# Altium schematic sheet 海关全向控制器主控板电路V2_USB-GL852G.SchDoc
size A4
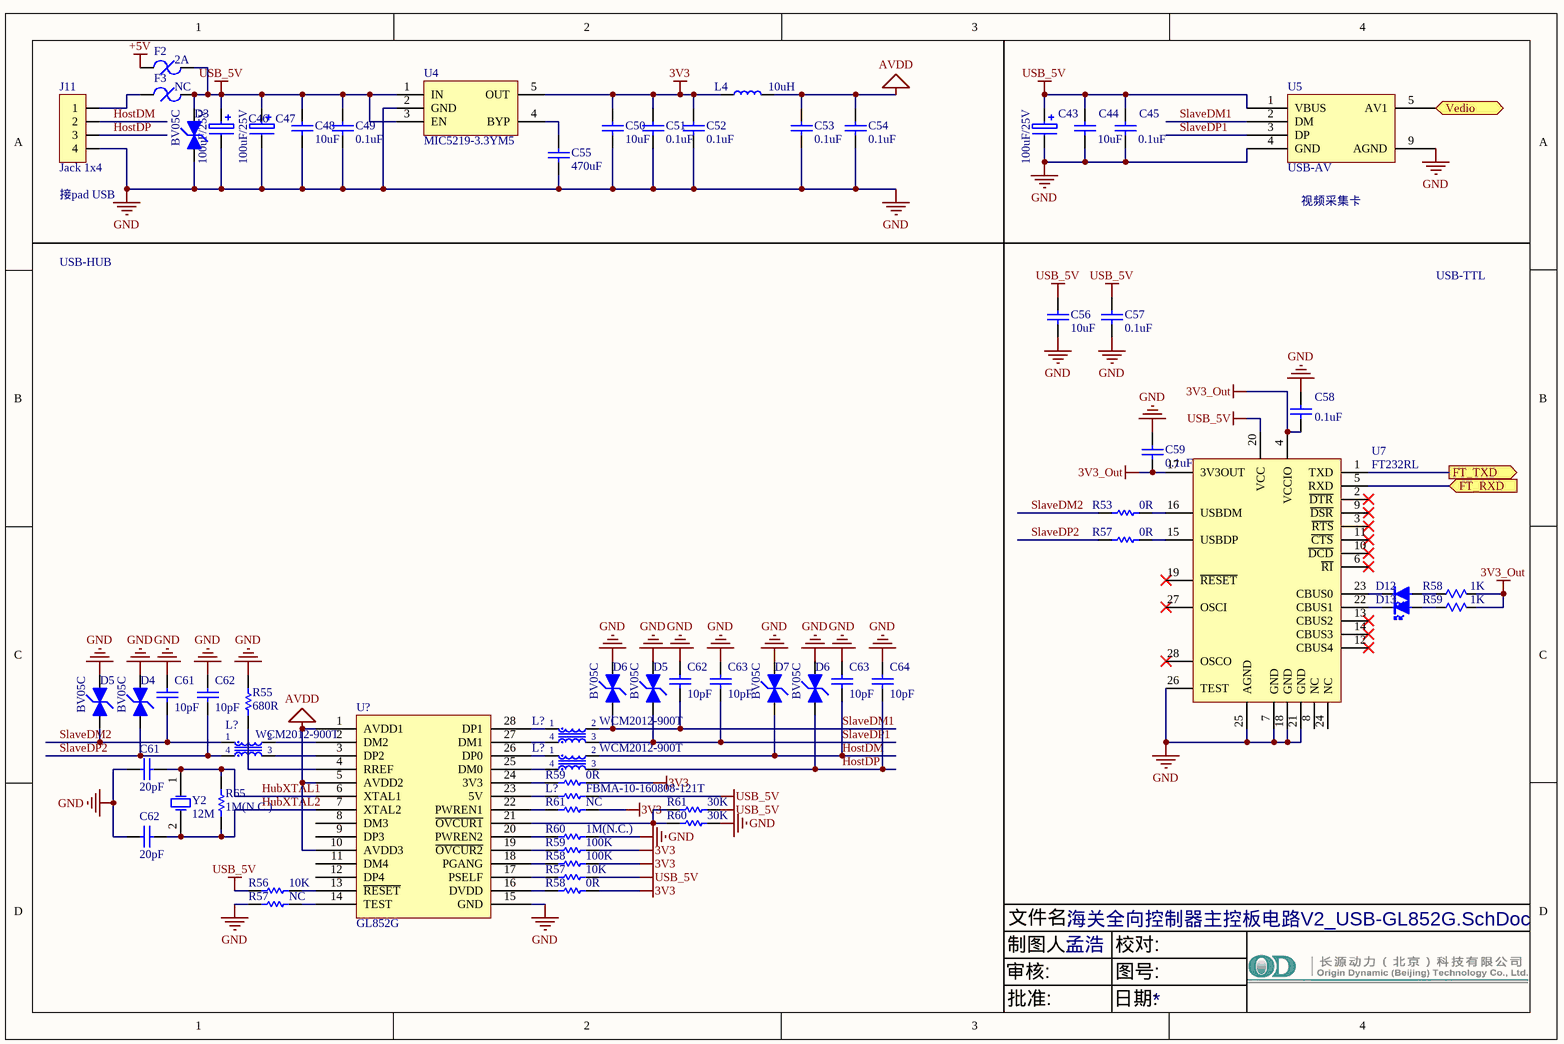
[diagram p0: 海关全向控制器主控板电路V2_USB-GL852G.SchDoc]

## Parts
(Parts that share a designator on the sheet are numbered #1, #2 ... from top to bottom, then left to right.)
C43  100uF/25V  [C7343]
C44  10uF  [C0603]
C45  0.1uF  [C0603]
C46  100uF/25V  [C7343]
C47  100uF/25V  [C7343]
C48  10uF  [C0603]
C49  0.1uF  [C0603]
C50  10uF  [C0603]
C51  0.1uF  [C0603]
C52  0.1uF  [C0603]
C53  0.1uF  [C0603]
C54  0.1uF  [C0603]
C55  470uF  [C0603]
C56  10uF  [C0603]
C57  0.1uF  [C0603]
C58  0.1uF  [C0603]
C59  0.1uF  [C0603]
C61#1  10pF  [C0603]
C61#2  20pF  [C0603]
C62#1  10pF  [C0603]
C62#2  10pF  [C0603]
C62#3  20pF  [C0603]
C63#1  10pF  [C0603]
C63#2  10pF  [C0603]
C64  10pF  [C0603]
D3  BV05C  [SOD323]
D4  BV05C  [SOD323]
D5#1  BV05C  [SOD323]
D5#2  BV05C  [SOD323]
D6#1  BV05C  [SOD323]
D6#2  BV05C  [SOD323]
D7  BV05C  [SOD323]
D12  LED  [LED0603]  (value not drawn)
D13  LED  [LED0603]  (value not drawn)
F2  2A  [F1218]
F3  NC  [F1218]
J11  Jack 1x4  [ZH1.5-4AWD]
L4  10uH  [L0805]
L?#1  WCM2012-900T  [WCM2012-900T]
L?#2  WCM2012-900T  [WCM2012-900T]
L?#3  WCM2012-900T  [WCM2012-900T]
L?#4  FBMA-10-160808-121T  [R0603]
R53  0R  [R0603]
R55  680R  [R0603]
R56  10K  [R0603]
R57#1  0R  [R0603]
R57#2  10K  [R0603]
R57#3  NC  [R0603]
R58#1  1K  [R0603]
R58#2  100K  [R0603]
R58#3  0R  [R0603]
R59#1  1K  [R0603]
R59#2  0R  [R0603]
R59#3  100K  [R0603]
R60#1  30K  [R0603]
R60#2  1M(N.C.)  [R0603]
R61#1  NC  [R0603]
R61#2  30K  [R0603]
R65  1M(N.C.)  [R0603]
U4  MIC5219-3.3YM5  [SOT-23-5]
U5  USB-AV  [USB-AV]
U7  FT232RL  [SSOP-28]
U?  GL852G  [SSOP-28]
Y2  12M  [HC49S]

## Ports
FT_RXD (in), FT_TXD (out), Vedio (in)

## Nets
3V3: C50.1 C51.2 C52.2 L4.1 R58#2.1 R58#3.1 R59#2.1 R59#3.1 R61#1.1 U4.5(OUT)
3V3_Out: C58.2 C59.1 R58#1.1 R59#1.1 U7.4(VCCIO) U7.17(3V3OUT)
+5V: F2.1
AVDD: C53.2 C54.2 L4.2 U?.1(AVDD1) U?.5(AVDD2) U?.10(AVDD3)
GND: C43.2 C44.2 C45.1 C46.2 C47.2 C48.2 C49.1 C50.2 C51.1 C52.1 C53.1 C54.1 C55.1 C56.2 C57.1 C58.1 C59.2 C61#1.2 C61#2.2 C62#1.2 C62#2.2 C62#3.2 C63#1.2 C63#2.2 C64.2 D3.2(K) D4.1(A) D5#1.1(A) D5#2.1(A) D6#1.1(A) D6#2.1(A) D7.1(A) J11.4 R55.2 R57#3.2 R60#1.1 R60#2.1 U4.2(GND) U5.4(GND) U5.9(AGND) U7.7(GND) U7.18(GND) U7.21(GND) U7.25(AGND) U7.26(TEST) U?.15(GND)
USB_5V: C43.1 C44.1 C45.2 C46.1 C47.1 C48.1 C49.2 C56.1 C57.2 D3.1(A) F2.2 F3.2 L?#4.2 R56.2 R57#2.1 R61#2.1 U4.1(IN) U4.3(EN) U5.1(VBUS) U7.20(VCC)
FT_RXD: U7.5(RXD) ; port FT_RXD
FT_TXD: U7.1(TXD) ; port FT_TXD
HostDM: C62#1.1 C63#1.1 C63#2.1 D5#1.2(K) D6#1.2(K) D7.2(K) J11.2 L?#1.2 L?#1.3 L?#3.2 U5.2(DM) U5.3(DP)  [also labelled SlaveDM1, SlaveDP1]
HostDP: C64.1 D6#2.2(K) J11.3 L?#3.3
HubXTAL1: C61#2.1 R65.2 U?.6(XTAL1) Y2.1(OSC1)
HubXTAL2: C62#3.1 R65.1 U?.7(XTAL2) Y2.2(OSC2)
SlaveDM2: C61#1.1 D5#2.2(K) L?#2.1 R53.1
SlaveDP2: C62#2.1 D4.2(K) L?#2.4 R57#1.1
Vedio: U5.5(AV1) ; port Vedio
NetC55_2: C55.2 U4.4(BYP)
NetD12_1: D12.1(A) R58#1.2
NetD12_2: D12.2(K) U7.23(CBUS0)
NetD13_1: D13.1(A) R59#1.2
NetD13_2: D13.2(K) U7.22(CBUS1)
NetF3_1: F3.1 J11.1
NetL?#1_1: L?#1.1 U?.28(DP1)
NetL?#1_4: L?#1.4 U?.27(DM1)
NetL?#2_2: L?#2.2 U?.2(DM2)
NetL?#2_3: L?#2.3 U?.3(DP2)
NetL?#3_1: L?#3.1 U?.26(DP0)
NetL?#3_4: L?#3.4 U?.25(DM0)
NetL?#4_1: L?#4.1 U?.23(5V)
NetR53_2: R53.2 U7.16(USBDM)
NetR55_1: R55.1 U?.4(RREF)
NetR56_1: R56.1 U?.13(~{RESET})
NetR57#1_2: R57#1.2 U7.15(USBDP)
NetR57#2_2: R57#2.2 U?.17(PSELF)
NetR57#3_1: R57#3.1 U?.14(TEST)
NetR58#2_2: R58#2.2 U?.18(PGANG)
NetR58#3_2: R58#3.2 U?.16(DVDD)
NetR59#2_2: R59#2.2 U?.24(3V3)
NetR59#3_2: R59#3.2 U?.19(~{OVCUR2})
NetR60#1_2: R60#1.2 R61#2.2 U?.21(~{OVCUR1})
NetR60#2_2: R60#2.2 U?.20(PWREN2)
NetR61#1_2: R61#1.2 U?.22(PWREN1)

Not connected (* = marked no-connect by the designer): U7 2(~{DTR})* 3(~{RTS})* 6(~{RI})* 8(NC) 9(~{DSR})* 10(~{DCD})* 11(~{CTS})* 12(CBUS4)* 13(CBUS2)* 14(CBUS3)* 19(~{RESET})* 24(NC) 27(OSCI)* 28(OSCO)*; U? 8(DM3) 9(DP3) 11(DM4) 12(DP4)

## Notes on the sheet
- (near J11) 接pad USB
- (near U5) 视频采集卡
- USB-HUB
- USB-TTL
- 文件名:
- 审核:
- 制图人:
- 孟浩
- 校对:
- 图号:
- 批准:
- 日期:

## Library data of the parts
C43 C46 C47 = Cap Poll
C44 C48 C50 C56 = CAP: Published: 8-Jun-2000; LatestRevisionDate: 17-Jul-2002; LatestRevisionNote: Re-released for DXP Platform.; PackageReference: RAD-0.3; Publisher: Altium Limited; Value: 10uF
C45 C49 C51-C55 C57 C59 C61#1 C61#2 C62#1-C62#3 C63#1 C63#2 C64 = Cap Semi
C58 = Cap: Capacitor; Value: 22pF; Published: 8-Jun-2000; Revision: July-2002: Re-released for DXP Platform.; Publisher: Altium Limited
D3 D4 D5#1 D5#2 D6#1 D6#2 D7 = Diode-TVS
F2 F3 = Fuse2
J11 = Jack 1x4: 插座
L4 = Inductor
L?#4 R53 R55 R56 R57#1-R57#3 R58#2 R58#3 R59#2 R59#3 R60#1 R60#2 R61#1 R61#2 R65 = Res
R58#1 R59#1 = Res: Resistor; Published: 8-Jun-2000; LatestRevisionDate: 04-Mar-2005; LatestRevisionNote: PCB Footprint replaced.; PackageReference: J1-0603; Publisher: Altium Limited; Value: 1K
U4 = MIC5205
U? = GL850G: USB 2.0 Low-Power HUB Controller
Y2 = XTAL: Crystal Oscillator; Published: 8-Jun-2000; LatestRevisionDate: 17-Jul-2002; LatestRevisionNote: Re-released for DXP Platform.; PackageReference: R38; Publisher: Altium Limited; PackageDescription: Crystal, Thru-Hole; 2 Leads; Body 3.1 x 8.2 mm (Dia.xH)